# EAGLE design 6-line-matrix (EAGLE 9.3.1)
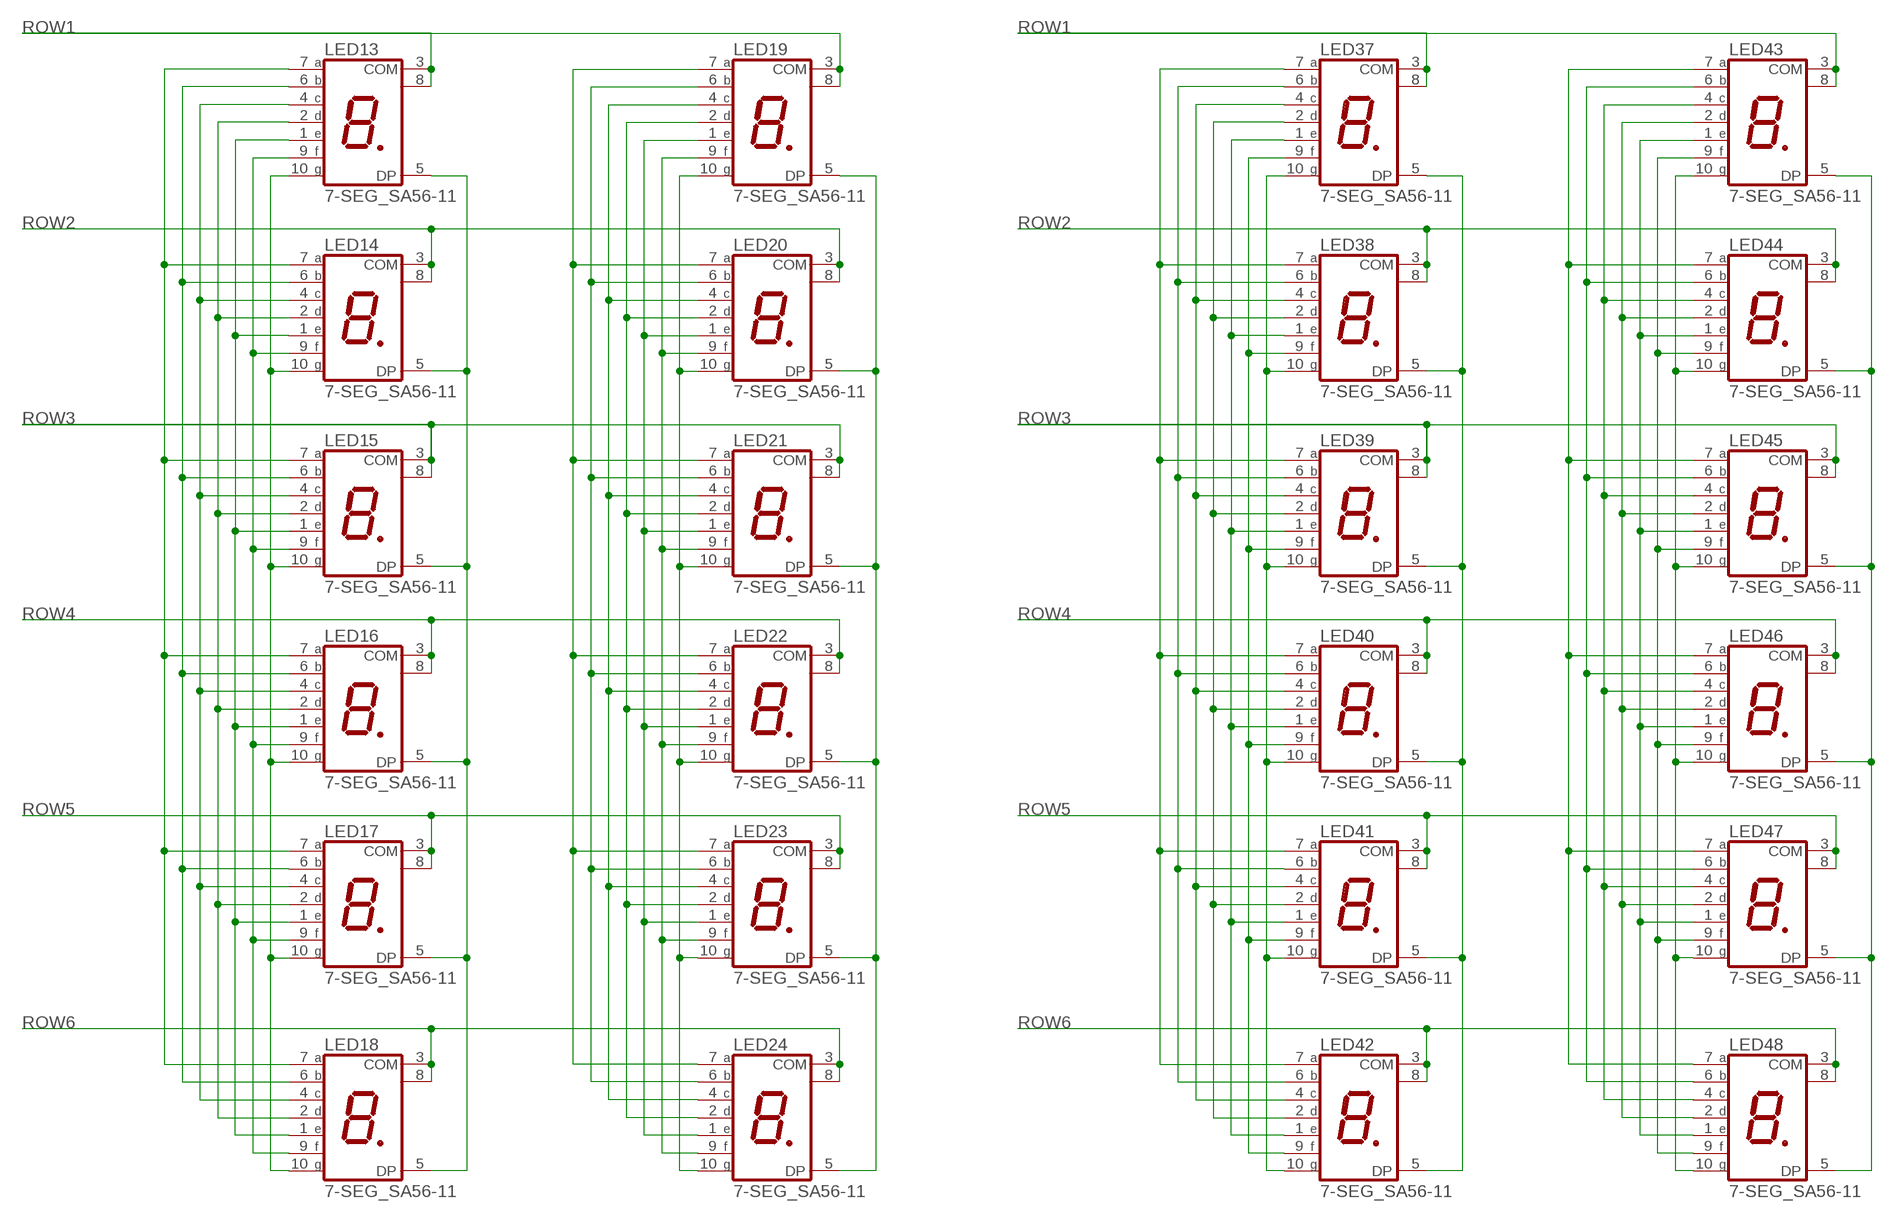
[diagram p0: schematic, sheet 1, part 1 of 2]
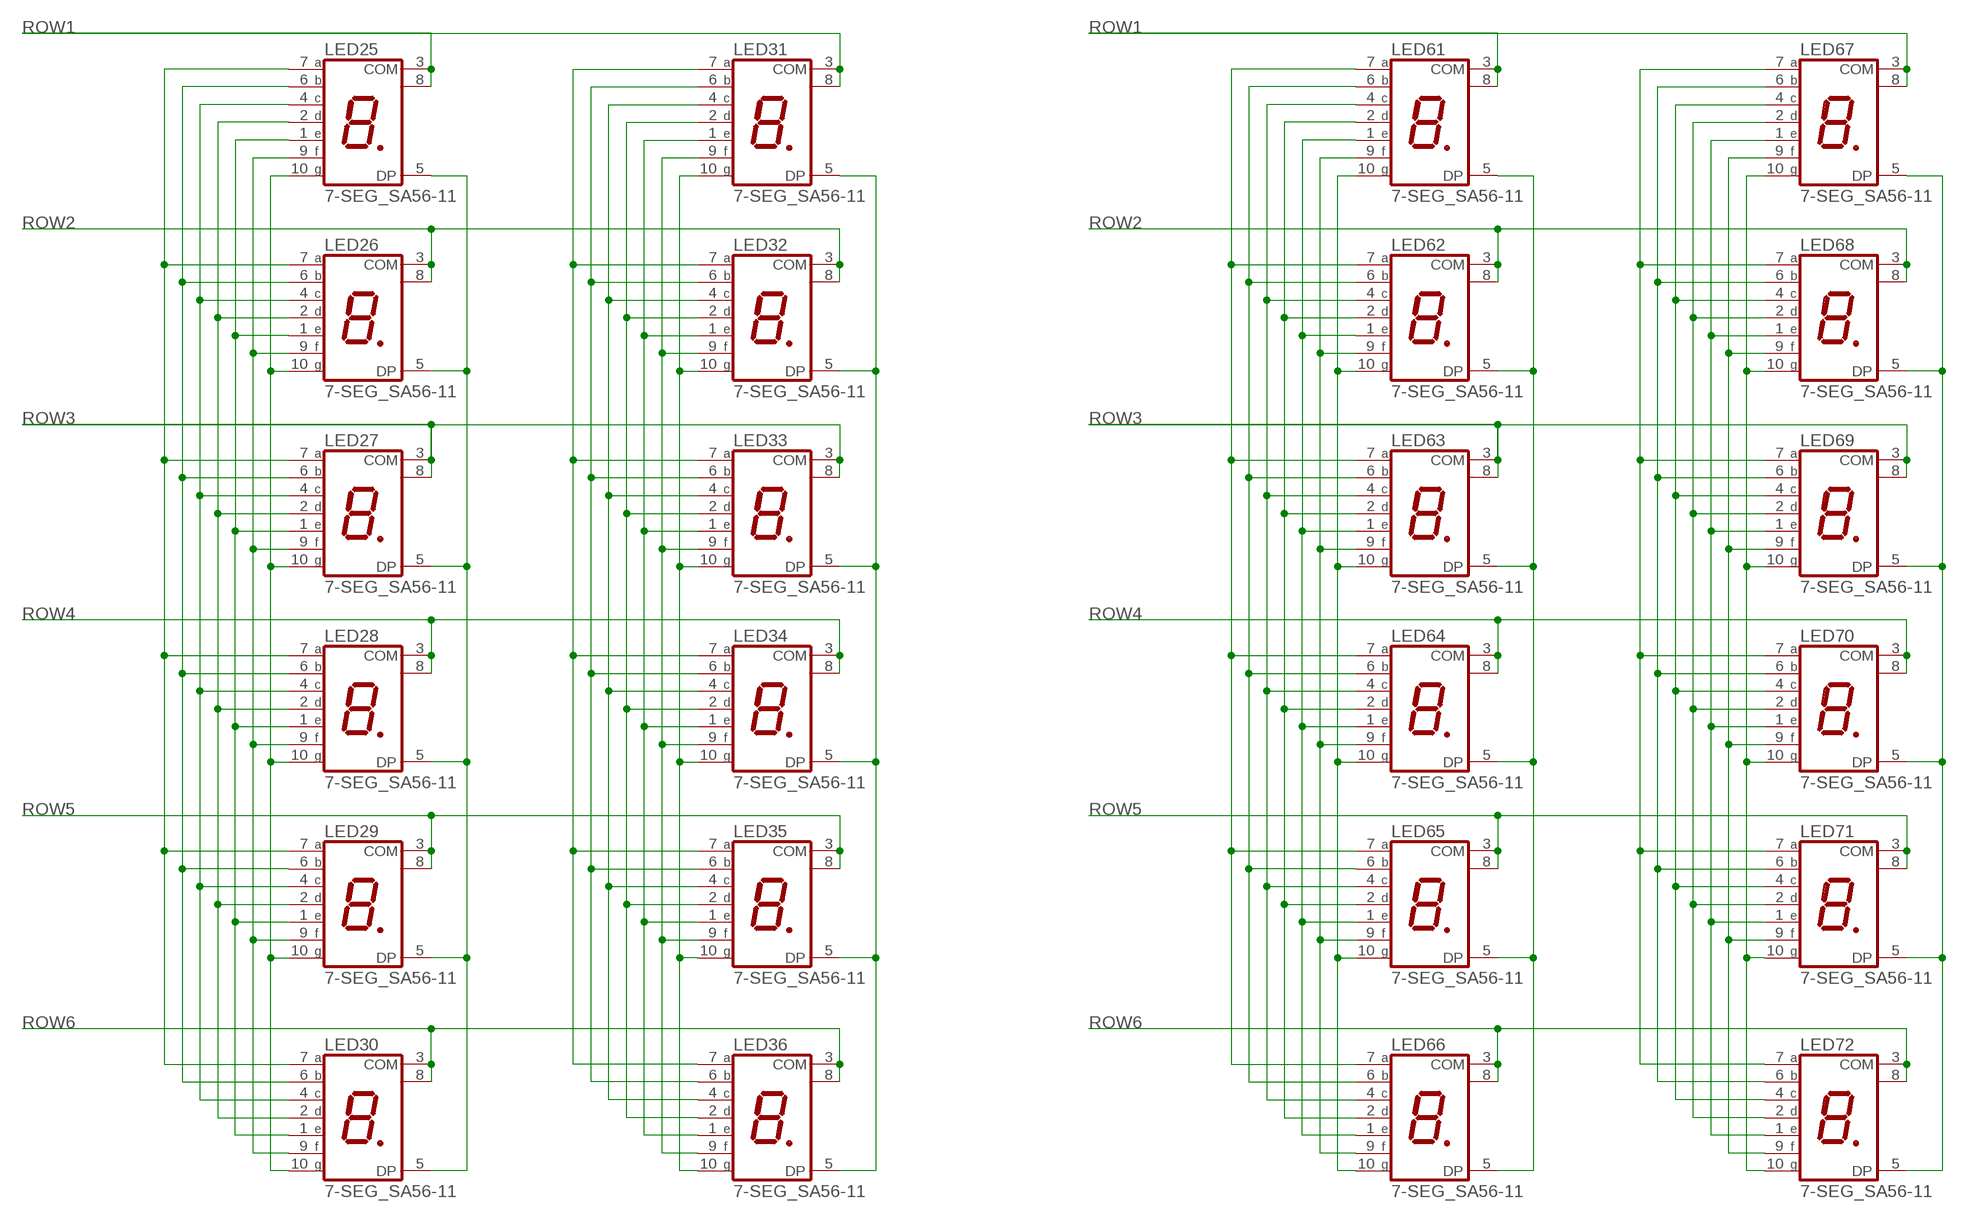
[diagram p1: schematic, sheet 1, part 2 of 2]

## Parts
LED13  7-SEG_SA56-11  [SA56-11]
LED14  7-SEG_SA56-11  [SA56-11]
LED15  7-SEG_SA56-11  [SA56-11]
LED16  7-SEG_SA56-11  [SA56-11]
LED17  7-SEG_SA56-11  [SA56-11]
LED18  7-SEG_SA56-11  [SA56-11]
LED19  7-SEG_SA56-11  [SA56-11]
LED20  7-SEG_SA56-11  [SA56-11]
LED21  7-SEG_SA56-11  [SA56-11]
LED22  7-SEG_SA56-11  [SA56-11]
LED23  7-SEG_SA56-11  [SA56-11]
LED24  7-SEG_SA56-11  [SA56-11]
LED25  7-SEG_SA56-11  [SA56-11]
LED26  7-SEG_SA56-11  [SA56-11]
LED27  7-SEG_SA56-11  [SA56-11]
LED28  7-SEG_SA56-11  [SA56-11]
LED29  7-SEG_SA56-11  [SA56-11]
LED30  7-SEG_SA56-11  [SA56-11]
LED31  7-SEG_SA56-11  [SA56-11]
LED32  7-SEG_SA56-11  [SA56-11]
LED33  7-SEG_SA56-11  [SA56-11]
LED34  7-SEG_SA56-11  [SA56-11]
LED35  7-SEG_SA56-11  [SA56-11]
LED36  7-SEG_SA56-11  [SA56-11]
LED37  7-SEG_SA56-11  [SA56-11]
LED38  7-SEG_SA56-11  [SA56-11]
LED39  7-SEG_SA56-11  [SA56-11]
LED40  7-SEG_SA56-11  [SA56-11]
LED41  7-SEG_SA56-11  [SA56-11]
LED42  7-SEG_SA56-11  [SA56-11]
LED43  7-SEG_SA56-11  [SA56-11]
LED44  7-SEG_SA56-11  [SA56-11]
LED45  7-SEG_SA56-11  [SA56-11]
LED46  7-SEG_SA56-11  [SA56-11]
LED47  7-SEG_SA56-11  [SA56-11]
LED48  7-SEG_SA56-11  [SA56-11]
LED61  7-SEG_SA56-11  [SA56-11]
LED62  7-SEG_SA56-11  [SA56-11]
LED63  7-SEG_SA56-11  [SA56-11]
LED64  7-SEG_SA56-11  [SA56-11]
LED65  7-SEG_SA56-11  [SA56-11]
LED66  7-SEG_SA56-11  [SA56-11]
LED67  7-SEG_SA56-11  [SA56-11]
LED68  7-SEG_SA56-11  [SA56-11]
LED69  7-SEG_SA56-11  [SA56-11]
LED70  7-SEG_SA56-11  [SA56-11]
LED71  7-SEG_SA56-11  [SA56-11]
LED72  7-SEG_SA56-11  [SA56-11]

## Nets
N$17: LED13.7(A) LED14.7(A) LED15.7(A) LED16.7(A) LED17.7(A) LED18.7(A)
N$18: LED13.6(B) LED14.6(B) LED15.6(B) LED16.6(B) LED17.6(B) LED18.6(B)
N$19: LED13.10(G) LED14.10(G) LED15.10(G) LED16.10(G) LED17.10(G) LED18.10(G)
N$20: LED13.9(F) LED14.9(F) LED15.9(F) LED16.9(F) LED17.9(F) LED18.9(F)
N$21: LED13.1(E) LED14.1(E) LED15.1(E) LED16.1(E) LED17.1(E) LED18.1(E)
N$22: LED13.2(D) LED14.2(D) LED15.2(D) LED16.2(D) LED17.2(D) LED18.2(D)
N$23: LED13.4(C) LED14.4(C) LED15.4(C) LED16.4(C) LED17.4(C) LED18.4(C)
N$24: LED13.5(DP) LED14.5(DP) LED15.5(DP) LED16.5(DP) LED17.5(DP) LED18.5(DP)
N$25: LED19.10(G) LED20.10(G) LED21.10(G) LED22.10(G) LED23.10(G) LED24.10(G)
N$26: LED19.9(F) LED20.9(F) LED21.9(F) LED22.9(F) LED23.9(F) LED24.9(F)
N$27: LED19.1(E) LED20.1(E) LED21.1(E) LED22.1(E) LED23.1(E) LED24.1(E)
N$28: LED19.2(D) LED20.2(D) LED21.2(D) LED22.2(D) LED23.2(D) LED24.2(D)
N$29: LED19.4(C) LED20.4(C) LED21.4(C) LED22.4(C) LED23.4(C) LED24.4(C)
N$30: LED19.6(B) LED20.6(B) LED21.6(B) LED22.6(B) LED23.6(B) LED24.6(B)
N$31: LED19.7(A) LED20.7(A) LED21.7(A) LED22.7(A) LED23.7(A) LED24.7(A)
N$32: LED19.5(DP) LED20.5(DP) LED21.5(DP) LED22.5(DP) LED23.5(DP) LED24.5(DP)
N$33: LED25.7(A) LED26.7(A) LED27.7(A) LED28.7(A) LED29.7(A) LED30.7(A)
N$34: LED25.6(B) LED26.6(B) LED27.6(B) LED28.6(B) LED29.6(B) LED30.6(B)
N$35: LED25.10(G) LED26.10(G) LED27.10(G) LED28.10(G) LED29.10(G) LED30.10(G)
N$36: LED25.9(F) LED26.9(F) LED27.9(F) LED28.9(F) LED29.9(F) LED30.9(F)
N$37: LED25.1(E) LED26.1(E) LED27.1(E) LED28.1(E) LED29.1(E) LED30.1(E)
N$38: LED25.2(D) LED26.2(D) LED27.2(D) LED28.2(D) LED29.2(D) LED30.2(D)
N$39: LED25.4(C) LED26.4(C) LED27.4(C) LED28.4(C) LED29.4(C) LED30.4(C)
N$40: LED25.5(DP) LED26.5(DP) LED27.5(DP) LED28.5(DP) LED29.5(DP) LED30.5(DP)
N$41: LED31.10(G) LED32.10(G) LED33.10(G) LED34.10(G) LED35.10(G) LED36.10(G)
N$42: LED31.9(F) LED32.9(F) LED33.9(F) LED34.9(F) LED35.9(F) LED36.9(F)
N$43: LED31.1(E) LED32.1(E) LED33.1(E) LED34.1(E) LED35.1(E) LED36.1(E)
N$44: LED31.2(D) LED32.2(D) LED33.2(D) LED34.2(D) LED35.2(D) LED36.2(D)
N$45: LED31.4(C) LED32.4(C) LED33.4(C) LED34.4(C) LED35.4(C) LED36.4(C)
N$46: LED31.6(B) LED32.6(B) LED33.6(B) LED34.6(B) LED35.6(B) LED36.6(B)
N$47: LED31.7(A) LED32.7(A) LED33.7(A) LED34.7(A) LED35.7(A) LED36.7(A)
N$48: LED31.5(DP) LED32.5(DP) LED33.5(DP) LED34.5(DP) LED35.5(DP) LED36.5(DP)
N$49: LED37.7(A) LED38.7(A) LED39.7(A) LED40.7(A) LED41.7(A) LED42.7(A)
N$50: LED37.6(B) LED38.6(B) LED39.6(B) LED40.6(B) LED41.6(B) LED42.6(B)
N$51: LED37.10(G) LED38.10(G) LED39.10(G) LED40.10(G) LED41.10(G) LED42.10(G)
N$52: LED37.9(F) LED38.9(F) LED39.9(F) LED40.9(F) LED41.9(F) LED42.9(F)
N$53: LED37.1(E) LED38.1(E) LED39.1(E) LED40.1(E) LED41.1(E) LED42.1(E)
N$54: LED37.2(D) LED38.2(D) LED39.2(D) LED40.2(D) LED41.2(D) LED42.2(D)
N$55: LED37.4(C) LED38.4(C) LED39.4(C) LED40.4(C) LED41.4(C) LED42.4(C)
N$56: LED37.5(DP) LED38.5(DP) LED39.5(DP) LED40.5(DP) LED41.5(DP) LED42.5(DP)
N$57: LED43.10(G) LED44.10(G) LED45.10(G) LED46.10(G) LED47.10(G) LED48.10(G)
N$58: LED43.9(F) LED44.9(F) LED45.9(F) LED46.9(F) LED47.9(F) LED48.9(F)
N$59: LED43.1(E) LED44.1(E) LED45.1(E) LED46.1(E) LED47.1(E) LED48.1(E)
N$60: LED43.2(D) LED44.2(D) LED45.2(D) LED46.2(D) LED47.2(D) LED48.2(D)
N$61: LED43.4(C) LED44.4(C) LED45.4(C) LED46.4(C) LED47.4(C) LED48.4(C)
N$62: LED43.6(B) LED44.6(B) LED45.6(B) LED46.6(B) LED47.6(B) LED48.6(B)
N$63: LED43.7(A) LED44.7(A) LED45.7(A) LED46.7(A) LED47.7(A) LED48.7(A)
N$64: LED43.5(DP) LED44.5(DP) LED45.5(DP) LED46.5(DP) LED47.5(DP) LED48.5(DP)
N$81: LED61.7(A) LED62.7(A) LED63.7(A) LED64.7(A) LED65.7(A) LED66.7(A)
N$82: LED61.6(B) LED62.6(B) LED63.6(B) LED64.6(B) LED65.6(B) LED66.6(B)
N$83: LED61.10(G) LED62.10(G) LED63.10(G) LED64.10(G) LED65.10(G) LED66.10(G)
N$84: LED61.9(F) LED62.9(F) LED63.9(F) LED64.9(F) LED65.9(F) LED66.9(F)
N$85: LED61.1(E) LED62.1(E) LED63.1(E) LED64.1(E) LED65.1(E) LED66.1(E)
N$86: LED61.2(D) LED62.2(D) LED63.2(D) LED64.2(D) LED65.2(D) LED66.2(D)
N$87: LED61.4(C) LED62.4(C) LED63.4(C) LED64.4(C) LED65.4(C) LED66.4(C)
N$88: LED61.5(DP) LED62.5(DP) LED63.5(DP) LED64.5(DP) LED65.5(DP) LED66.5(DP)
N$89: LED67.10(G) LED68.10(G) LED69.10(G) LED70.10(G) LED71.10(G) LED72.10(G)
N$90: LED67.9(F) LED68.9(F) LED69.9(F) LED70.9(F) LED71.9(F) LED72.9(F)
N$91: LED67.1(E) LED68.1(E) LED69.1(E) LED70.1(E) LED71.1(E) LED72.1(E)
N$92: LED67.2(D) LED68.2(D) LED69.2(D) LED70.2(D) LED71.2(D) LED72.2(D)
N$93: LED67.4(C) LED68.4(C) LED69.4(C) LED70.4(C) LED71.4(C) LED72.4(C)
N$94: LED67.6(B) LED68.6(B) LED69.6(B) LED70.6(B) LED71.6(B) LED72.6(B)
N$95: LED67.7(A) LED68.7(A) LED69.7(A) LED70.7(A) LED71.7(A) LED72.7(A)
N$96: LED67.5(DP) LED68.5(DP) LED69.5(DP) LED70.5(DP) LED71.5(DP) LED72.5(DP)
ROW1: LED13.3(COM) LED13.8(COM) LED19.3(COM) LED19.8(COM) LED25.3(COM) LED25.8(COM) LED31.3(COM) LED31.8(COM) LED37.3(COM) LED37.8(COM) LED43.3(COM) LED43.8(COM) LED61.3(COM) LED61.8(COM) LED67.3(COM) LED67.8(COM)
ROW2: LED14.3(COM) LED14.8(COM) LED20.3(COM) LED20.8(COM) LED26.3(COM) LED26.8(COM) LED32.3(COM) LED32.8(COM) LED38.3(COM) LED38.8(COM) LED44.3(COM) LED44.8(COM) LED62.3(COM) LED62.8(COM) LED68.3(COM) LED68.8(COM)
ROW3: LED15.3(COM) LED15.8(COM) LED21.3(COM) LED21.8(COM) LED27.3(COM) LED27.8(COM) LED33.3(COM) LED33.8(COM) LED39.3(COM) LED39.8(COM) LED45.3(COM) LED45.8(COM) LED63.3(COM) LED63.8(COM) LED69.3(COM) LED69.8(COM)
ROW4: LED16.3(COM) LED16.8(COM) LED22.3(COM) LED22.8(COM) LED28.3(COM) LED28.8(COM) LED34.3(COM) LED34.8(COM) LED40.3(COM) LED40.8(COM) LED46.3(COM) LED46.8(COM) LED64.3(COM) LED64.8(COM) LED70.3(COM) LED70.8(COM)
ROW5: LED17.3(COM) LED17.8(COM) LED23.3(COM) LED23.8(COM) LED29.3(COM) LED29.8(COM) LED35.3(COM) LED35.8(COM) LED41.3(COM) LED41.8(COM) LED47.3(COM) LED47.8(COM) LED65.3(COM) LED65.8(COM) LED71.3(COM) LED71.8(COM)
ROW6: LED18.3(COM) LED18.8(COM) LED24.3(COM) LED24.8(COM) LED30.3(COM) LED30.8(COM) LED36.3(COM) LED36.8(COM) LED42.3(COM) LED42.8(COM) LED48.3(COM) LED48.8(COM) LED66.3(COM) LED66.8(COM) LED72.3(COM) LED72.8(COM)

## Library data of the parts
LED13-LED48 LED61-LED72 = display-kingbright:7-SEG_: Kingbright 14.2mm (0.56 INCH) SINGLE DIGIT NUMERIC DUISPLAY Source: SA56-11EWA(Ver1189471036.pdf; OC_FARNELL: unknown; OC_NEWARK: unknown

## Board
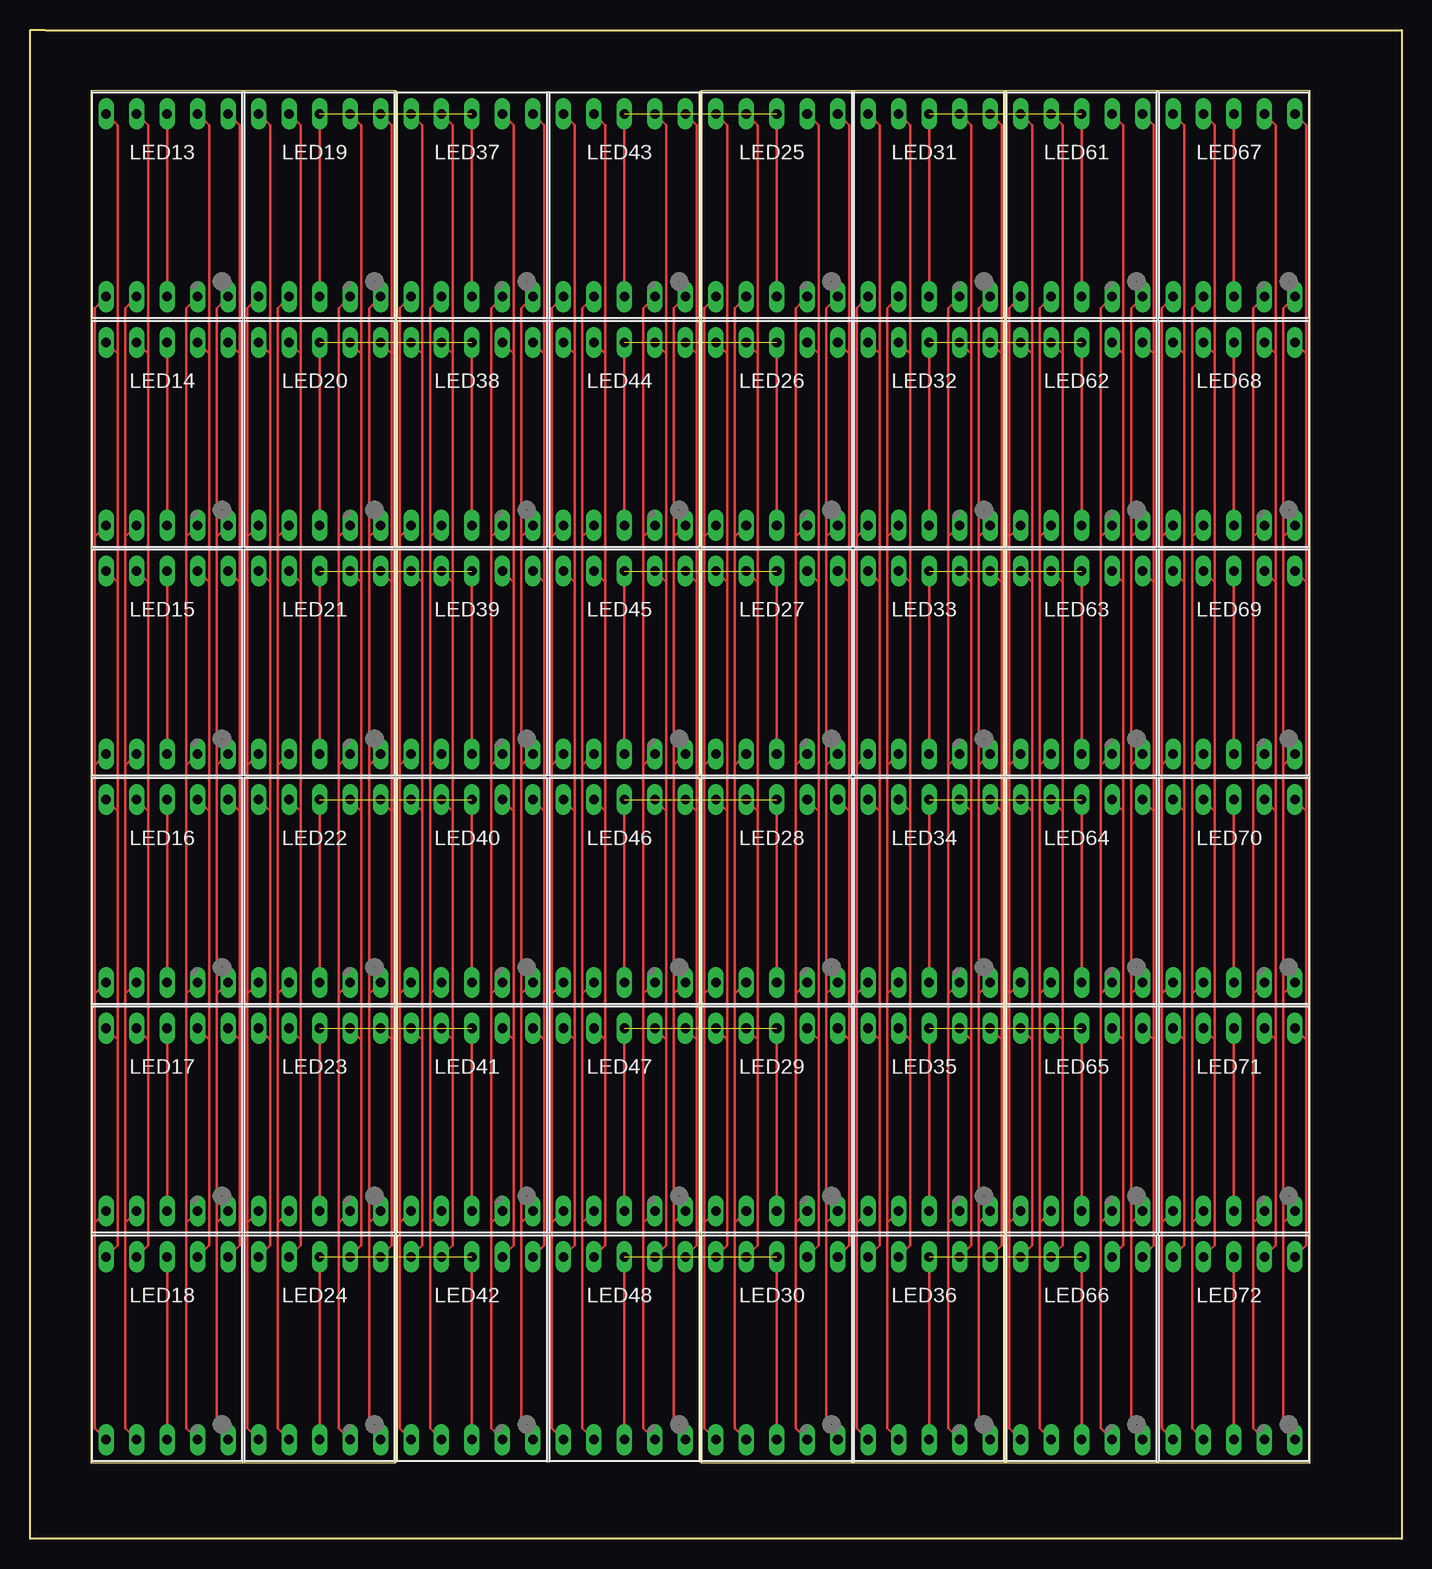
[diagram p2: board, top side]
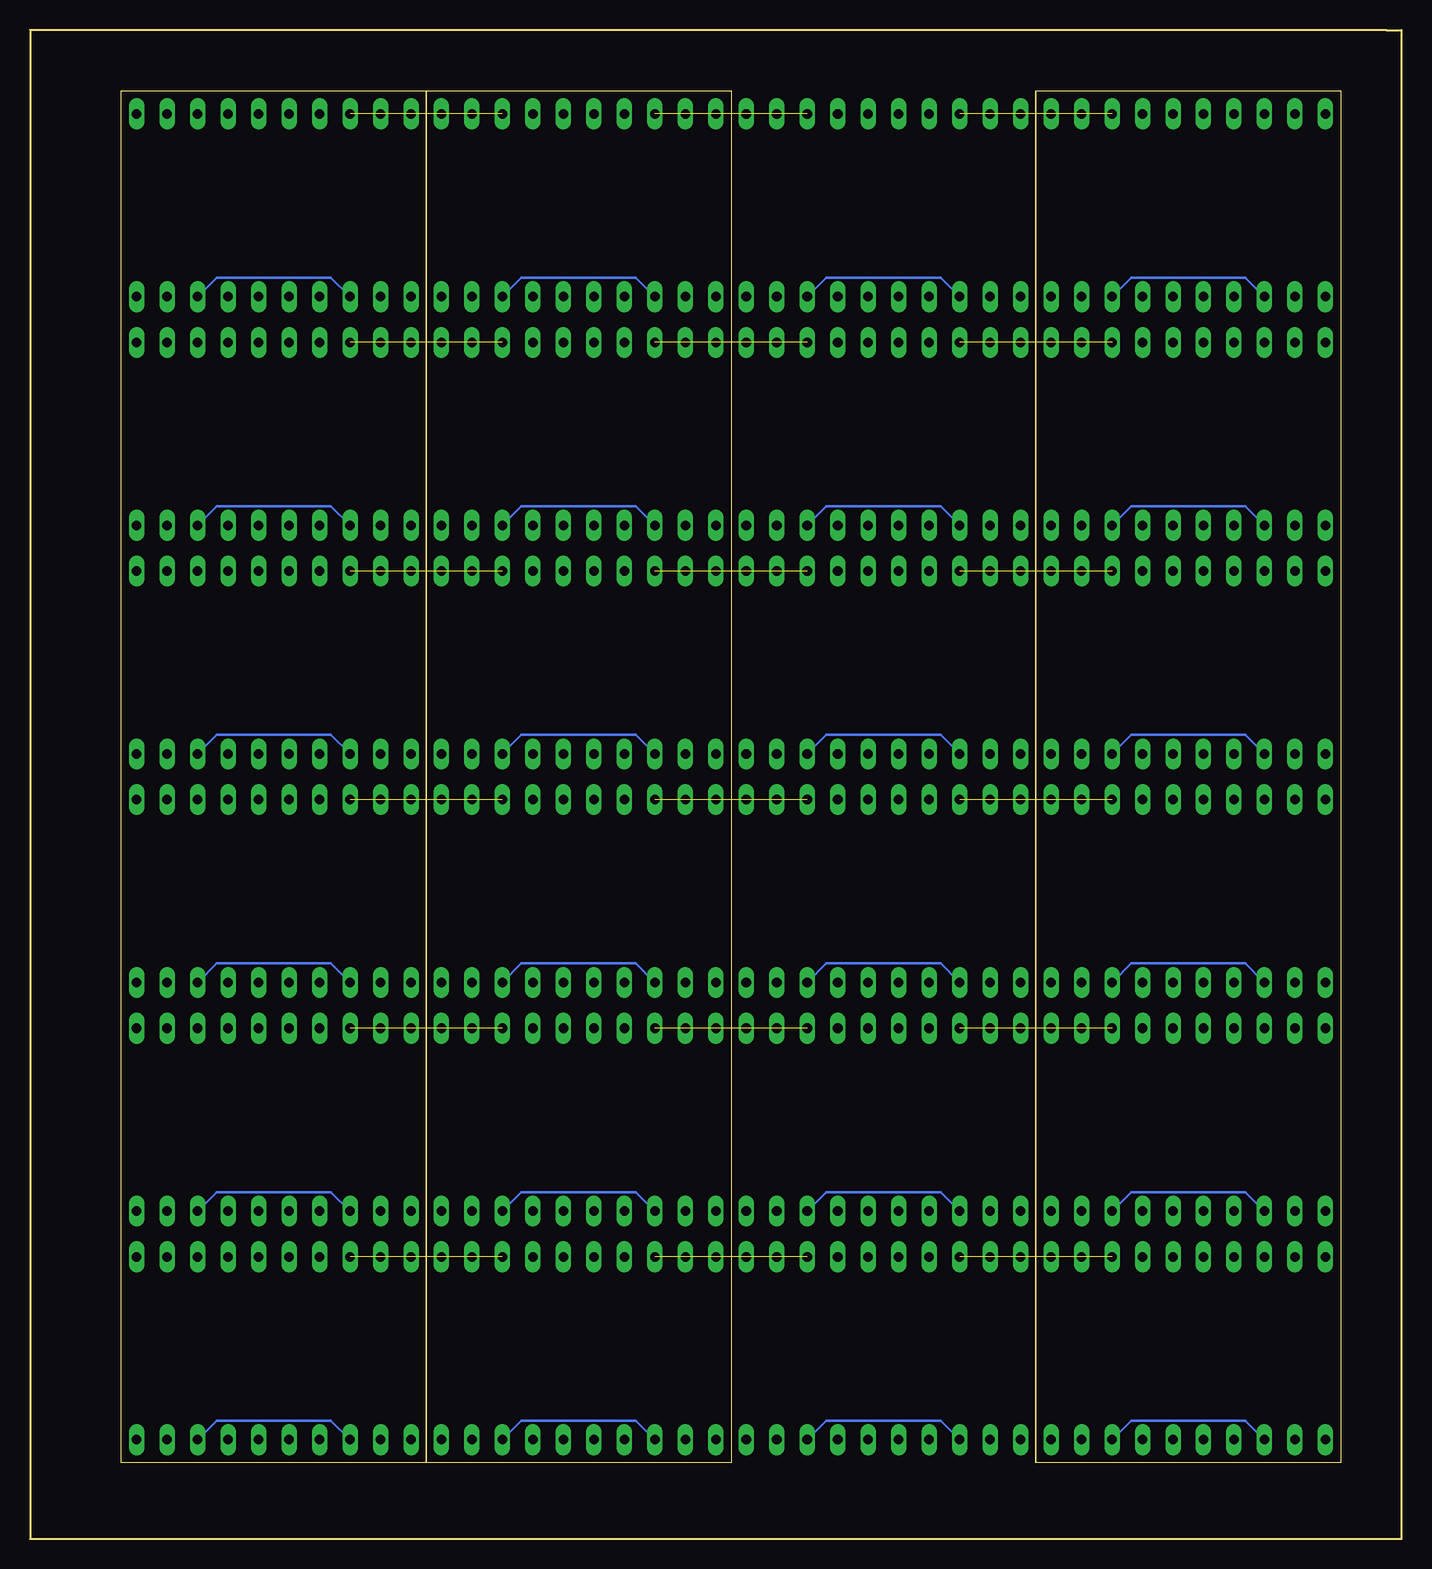
[diagram p3: board, bottom side, seen from below]

Size 114.3 x 125.73 mm. Coordinates in mm from the lower left corner, seen from the top.
Outline: 30.48,6.35 5.08,6.35 5.08,120.65 30.48,120.65
Outline: 30.48,6.35 30.48,120.65
Outline: 30.48,120.65 30.48,6.35
Outline: 81.28,6.35 55.88,6.35 55.88,120.65 81.28,120.65
Outline: 81.28,6.35 81.28,120.65
Outline: 81.28,6.35 106.68,6.35 106.68,120.65 81.28,120.65
Outline: 81.28,120.65 81.28,6.35
Outline: 1.27,125.73 114.3,125.73 114.3,0 0,0 0,125.73 1.27,125.73
Copper layers (1*16): Top 0.035mm / dielectric 1.5mm / Bottom 0.035mm
Design rules "default": minimum track width 6mil, minimum drill 0.35mm, track to track 6mil, track to pad 6mil, pad to pad 6mil, via to via 6mil, smd to smd 6mil, copper to edge 40mil, drill to drill 6mil, minimum pad ring 10mil, minimum via ring 8mil, stop-mask expansion 4mil, vias tented up to drill 0mil, thermal gap 10mil

### Footprints (pad centres in the part's own frame; a part is rotated, then mirrored left to right if it is on the bottom)
SA56-11 = drill 0.8 long: 1 -5.08,-7.62; 2 -2.54,-7.62; 3 0,-7.62; 4 2.54,-7.62; 5 5.08,-7.62; 6 5.08,7.62; 7 2.54,7.62; 8 0,7.62; 9 -2.54,7.62; 10 -5.08,7.62

### Placement (x,y rotation side)
LED13  11.43,111.12 0 top
LED14  11.43,92.07 0 top
LED15  11.43,73.02 0 top
LED16  11.43,53.98 0 top
LED17  11.43,34.92 0 top
LED18  11.43,15.88 0 top
LED19  24.13,111.12 0 top
LED20  24.13,92.07 0 top
LED21  24.13,73.02 0 top
LED22  24.13,53.98 0 top
LED23  24.13,34.92 0 top
LED24  24.13,15.88 0 top
LED25  62.23,111.12 0 top
LED26  62.23,92.07 0 top
LED27  62.23,73.02 0 top
LED28  62.23,53.98 0 top
LED29  62.23,34.92 0 top
LED30  62.23,15.88 0 top
LED31  74.93,111.12 0 top
LED32  74.93,92.07 0 top
LED33  74.93,73.02 0 top
LED34  74.93,53.98 0 top
LED35  74.93,34.92 0 top
LED36  74.93,15.88 0 top
LED37  36.83,111.12 0 top
LED38  36.83,92.07 0 top
LED39  36.83,73.02 0 top
LED40  36.83,53.98 0 top
LED41  36.83,34.92 0 top
LED42  36.83,15.88 0 top
LED43  49.53,111.12 0 top
LED44  49.53,92.07 0 top
LED45  49.53,73.02 0 top
LED46  49.53,53.98 0 top
LED47  49.53,34.92 0 top
LED48  49.53,15.88 0 top
LED61  87.63,111.12 0 top
LED62  87.63,92.07 0 top
LED63  87.63,73.02 0 top
LED64  87.63,53.98 0 top
LED65  87.63,34.92 0 top
LED66  87.63,15.88 0 top
LED67  100.33,111.12 0 top
LED68  100.33,92.07 0 top
LED69  100.33,73.02 0 top
LED70  100.33,53.98 0 top
LED71  100.33,34.92 0 top
LED72  100.33,15.88 0 top

### Tracks (layer width: path | path; a pad name or v marks a point on that pad's centre or on a via)
N$17
  Top 0.203: LED18.7 14.92,24.45 14.92,41.59 | LED17.7 14.92,41.59 | 14.92,60.64 LED16.7 | 14.92,41.59 14.92,60.64 | 14.92,79.69 LED15.7 | 14.92,60.64 14.92,79.69 | 14.92,98.74 LED14.7 | 14.92,79.69 14.92,98.74 | LED13.7 14.92,117.79 14.92,98.74
N$18
  Top 0.203: LED18.6 17.46,24.45 17.46,41.59 | LED17.6 17.46,41.59 | 17.46,60.64 LED16.6 | 17.46,41.59 17.46,60.64 | 17.46,79.69 LED15.6 | 17.46,60.64 17.46,79.69 | 17.46,98.74 LED14.6 | 17.46,79.69 17.46,98.74 | LED13.6 17.46,117.79 17.46,98.74
N$19
  Top 0.203: LED18.10 7.3,24.45 7.3,41.59 | LED17.10 7.3,41.59 | 7.3,60.64 LED16.10 | 7.3,41.59 7.3,60.64 | 7.3,79.69 LED15.10 | 7.3,60.64 7.3,79.69 | 7.3,98.74 LED14.10 | 7.3,79.69 7.3,98.74 | LED13.10 7.3,117.79 7.3,98.74
N$20
  Top 0.203: LED18.9 9.84,24.45 9.84,41.59 | LED17.9 9.84,41.59 | 9.84,60.64 LED16.9 | 9.84,41.59 9.84,60.64 | 9.84,79.69 LED15.9 | 9.84,60.64 9.84,79.69 | 9.84,98.74 LED14.9 | 9.84,79.69 9.84,98.74 | LED13.9 9.84,117.79 9.84,98.74
N$21
  Top 0.203: LED18.1 5.4,9.21 5.4,26.35 | LED17.1 5.4,26.35 | 5.4,45.4 LED16.1 | 5.4,26.35 5.4,45.4 | 5.4,64.45 LED15.1 | 5.4,45.4 5.4,64.45 | 5.4,83.5 LED14.1 | 5.4,64.45 5.4,83.5 | LED13.1 5.4,102.55 5.4,83.5
N$22
  Top 0.203: LED18.2 7.94,9.21 7.94,26.35 | LED17.2 7.94,26.35 | 7.94,45.4 LED16.2 | 7.94,26.35 7.94,45.4 | 7.94,64.45 LED15.2 | 7.94,45.4 7.94,64.45 | 7.94,83.5 LED14.2 | 7.94,64.45 7.94,83.5 | LED13.2 7.94,102.55 7.94,83.5
N$23
  Top 0.203: LED18.4 13.02,9.21 13.02,26.35 | LED17.4 13.02,26.35 | 13.02,45.4 LED16.4 | 13.02,26.35 13.02,45.4 | 13.02,64.45 LED15.4 | 13.02,45.4 13.02,64.45 | 13.02,83.5 LED14.4 | 13.02,64.45 13.02,83.5 | LED13.4 13.02,102.55 13.02,83.5
N$24
  Top 0.203: LED18.5 15.56,9.21 15.56,26.35 | LED17.5 15.56,26.35 | 15.56,45.4 LED16.5 | 15.56,26.35 15.56,45.4 | 15.56,64.45 LED15.5 | 15.56,45.4 15.56,64.45 | 15.56,83.5 LED14.5 | 15.56,64.45 15.56,83.5 | LED13.5 15.56,102.55 15.56,83.5
N$25
  Top 0.203: LED24.10 20,24.45 20,41.59 | LED23.10 20,41.59 | 20,60.64 LED22.10 | 20,41.59 20,60.64 | 20,79.69 LED21.10 | 20,60.64 20,79.69 | 20,98.74 LED20.10 | 20,79.69 20,98.74 | LED19.10 20,117.79 20,98.74
N$26
  Top 0.203: LED24.9 22.54,24.45 22.54,41.59 | LED23.9 22.54,41.59 | 22.54,60.64 LED22.9 | 22.54,41.59 22.54,60.64 | 22.54,79.69 LED21.9 | 22.54,60.64 22.54,79.69 | 22.54,98.74 LED20.9 | 22.54,79.69 22.54,98.74 | LED19.9 22.54,117.79 22.54,98.74
N$27
  Top 0.203: LED24.1 18.1,9.21 18.1,26.35 | LED23.1 18.1,26.35 | 18.1,45.4 LED22.1 | 18.1,26.35 18.1,45.4 | 18.1,64.45 LED21.1 | 18.1,45.4 18.1,64.45 | 18.1,83.5 LED20.1 | 18.1,64.45 18.1,83.5 | LED19.1 18.1,102.55 18.1,83.5
N$28
  Top 0.203: LED24.2 20.64,9.21 20.64,26.35 | LED23.2 20.64,26.35 | 20.64,45.4 LED22.2 | 20.64,26.35 20.64,45.4 | 20.64,64.45 LED21.2 | 20.64,45.4 20.64,64.45 | 20.64,83.5 LED20.2 | 20.64,64.45 20.64,83.5 | LED19.2 20.64,102.55 20.64,83.5
N$29
  Top 0.203: LED24.4 25.72,9.21 25.72,26.35 | LED23.4 25.72,26.35 | 25.72,45.4 LED22.4 | 25.72,26.35 25.72,45.4 | 25.72,64.45 LED21.4 | 25.72,45.4 25.72,64.45 | 25.72,83.5 LED20.4 | 25.72,64.45 25.72,83.5 | LED19.4 25.72,102.55 25.72,83.5
N$30
  Top 0.203: LED24.6 30.16,24.45 30.16,41.59 | LED23.6 30.16,41.59 | 30.16,60.64 LED22.6 | 30.16,41.59 30.16,60.64 | 30.16,79.69 LED21.6 | 30.16,60.64 30.16,79.69 | 30.16,98.74 LED20.6 | 30.16,79.69 30.16,98.74 | LED19.6 30.16,117.79 30.16,98.74
N$31
  Top 0.203: LED24.7 27.62,24.45 27.62,41.59 | LED23.7 27.62,41.59 | 27.62,60.64 LED22.7 | 27.62,41.59 27.62,60.64 | 27.62,79.69 LED21.7 | 27.62,60.64 27.62,79.69 | 27.62,98.74 LED20.7 | 27.62,79.69 27.62,98.74 | LED19.7 27.62,117.79 27.62,98.74
N$32
  Top 0.203: LED24.5 28.26,9.21 28.26,26.35 | LED23.5 28.26,26.35 | 28.26,45.4 LED22.5 | 28.26,26.35 28.26,45.4 | 28.26,64.45 LED21.5 | 28.26,45.4 28.26,64.45 | 28.26,83.5 LED20.5 | 28.26,64.45 28.26,83.5 | LED19.5 28.26,102.55 28.26,83.5
N$33
  Top 0.203: LED30.7 65.72,24.45 65.72,41.59 | LED29.7 65.72,41.59 | 65.72,60.64 LED28.7 | 65.72,41.59 65.72,60.64 | 65.72,79.69 LED27.7 | 65.72,60.64 65.72,79.69 | 65.72,98.74 LED26.7 | 65.72,79.69 65.72,98.74 | LED25.7 65.72,117.79 65.72,98.74
N$34
  Top 0.203: LED30.6 68.26,24.45 68.26,41.59 | LED29.6 68.26,41.59 | 68.26,60.64 LED28.6 | 68.26,41.59 68.26,60.64 | 68.26,79.69 LED27.6 | 68.26,60.64 68.26,79.69 | 68.26,98.74 LED26.6 | 68.26,79.69 68.26,98.74 | LED25.6 68.26,117.79 68.26,98.74
N$35
  Top 0.203: LED30.10 58.1,24.45 58.1,41.59 | LED29.10 58.1,41.59 | 58.1,60.64 LED28.10 | 58.1,41.59 58.1,60.64 | 58.1,79.69 LED27.10 | 58.1,60.64 58.1,79.69 | 58.1,98.74 LED26.10 | 58.1,79.69 58.1,98.74 | LED25.10 58.1,117.79 58.1,98.74
N$36
  Top 0.203: LED30.9 60.64,24.45 60.64,41.59 | LED29.9 60.64,41.59 | 60.64,60.64 LED28.9 | 60.64,41.59 60.64,60.64 | 60.64,79.69 LED27.9 | 60.64,60.64 60.64,79.69 | 60.64,98.74 LED26.9 | 60.64,79.69 60.64,98.74 | LED25.9 60.64,117.79 60.64,98.74
N$37
  Top 0.203: LED30.1 56.2,9.21 56.2,26.35 | LED29.1 56.2,26.35 | 56.2,45.4 LED28.1 | 56.2,26.35 56.2,45.4 | 56.2,64.45 LED27.1 | 56.2,45.4 56.2,64.45 | 56.2,83.5 LED26.1 | 56.2,64.45 56.2,83.5 | LED25.1 56.2,102.55 56.2,83.5
N$38
  Top 0.203: LED30.2 58.74,9.21 58.74,26.35 | LED29.2 58.74,26.35 | 58.74,45.4 LED28.2 | 58.74,26.35 58.74,45.4 | 58.74,64.45 LED27.2 | 58.74,45.4 58.74,64.45 | 58.74,83.5 LED26.2 | 58.74,64.45 58.74,83.5 | LED25.2 58.74,102.55 58.74,83.5
N$39
  Top 0.203: LED30.4 63.82,9.21 63.82,26.35 | LED29.4 63.82,26.35 | 63.82,45.4 LED28.4 | 63.82,26.35 63.82,45.4 | 63.82,64.45 LED27.4 | 63.82,45.4 63.82,64.45 | 63.82,83.5 LED26.4 | 63.82,64.45 63.82,83.5 | LED25.4 63.82,102.55 63.82,83.5
N$40
  Top 0.203: LED30.5 66.36,9.21 66.36,26.35 | LED29.5 66.36,26.35 | 66.36,45.4 LED28.5 | 66.36,26.35 66.36,45.4 | 66.36,64.45 LED27.5 | 66.36,45.4 66.36,64.45 | 66.36,83.5 LED26.5 | 66.36,64.45 66.36,83.5 | LED25.5 66.36,102.55 66.36,83.5
N$41
  Top 0.203: LED36.10 70.8,24.45 70.8,41.59 | LED35.10 70.8,41.59 | 70.8,60.64 LED34.10 | 70.8,41.59 70.8,60.64 | 70.8,79.69 LED33.10 | 70.8,60.64 70.8,79.69 | 70.8,98.74 LED32.10 | 70.8,79.69 70.8,98.74 | LED31.10 70.8,117.79 70.8,98.74
N$42
  Top 0.203: LED36.9 73.34,24.45 73.34,41.59 | LED35.9 73.34,41.59 | 73.34,60.64 LED34.9 | 73.34,41.59 73.34,60.64 | 73.34,79.69 LED33.9 | 73.34,60.64 73.34,79.69 | 73.34,98.74 LED32.9 | 73.34,79.69 73.34,98.74 | LED31.9 73.34,117.79 73.34,98.74
N$43
  Top 0.203: LED36.1 68.9,9.21 68.9,26.35 | LED35.1 68.9,26.35 | 68.9,45.4 LED34.1 | 68.9,26.35 68.9,45.4 | 68.9,64.45 LED33.1 | 68.9,45.4 68.9,64.45 | 68.9,83.5 LED32.1 | 68.9,64.45 68.9,83.5 | LED31.1 68.9,102.55 68.9,83.5
N$44
  Top 0.203: LED36.2 71.44,9.21 71.44,26.35 | LED35.2 71.44,26.35 | 71.44,45.4 LED34.2 | 71.44,26.35 71.44,45.4 | 71.44,64.45 LED33.2 | 71.44,45.4 71.44,64.45 | 71.44,83.5 LED32.2 | 71.44,64.45 71.44,83.5 | LED31.2 71.44,102.55 71.44,83.5
N$45
  Top 0.203: LED36.4 76.52,9.21 76.52,26.35 | LED35.4 76.52,26.35 | 76.52,45.4 LED34.4 | 76.52,26.35 76.52,45.4 | 76.52,64.45 LED33.4 | 76.52,45.4 76.52,64.45 | 76.52,83.5 LED32.4 | 76.52,64.45 76.52,83.5 | LED31.4 76.52,102.55 76.52,83.5
N$46
  Top 0.203: LED36.6 80.96,24.45 80.96,41.59 | LED35.6 80.96,41.59 | 80.96,60.64 LED34.6 | 80.96,41.59 80.96,60.64 | 80.96,79.69 LED33.6 | 80.96,60.64 80.96,79.69 | 80.96,98.74 LED32.6 | 80.96,79.69 80.96,98.74 | LED31.6 80.96,117.79 80.96,98.74
N$47
  Top 0.203: LED36.7 78.42,24.45 78.42,41.59 | LED35.7 78.42,41.59 | 78.42,60.64 LED34.7 | 78.42,41.59 78.42,60.64 | 78.42,79.69 LED33.7 | 78.42,60.64 78.42,79.69 | 78.42,98.74 LED32.7 | 78.42,79.69 78.42,98.74 | LED31.7 78.42,117.79 78.42,98.74
N$48
  Top 0.203: LED36.5 79.06,9.21 79.06,26.35 | LED35.5 79.06,26.35 | 79.06,45.4 LED34.5 | 79.06,26.35 79.06,45.4 | 79.06,64.45 LED33.5 | 79.06,45.4 79.06,64.45 | 79.06,83.5 LED32.5 | 79.06,64.45 79.06,83.5 | LED31.5 79.06,102.55 79.06,83.5
N$49
  Top 0.203: LED42.7 40.32,24.45 40.32,41.59 | LED41.7 40.32,41.59 | 40.32,60.64 LED40.7 | 40.32,41.59 40.32,60.64 | 40.32,79.69 LED39.7 | 40.32,60.64 40.32,79.69 | 40.32,98.74 LED38.7 | 40.32,79.69 40.32,98.74 | LED37.7 40.32,117.79 40.32,98.74
N$50
  Top 0.203: LED42.6 42.86,24.45 42.86,41.59 | LED41.6 42.86,41.59 | 42.86,60.64 LED40.6 | 42.86,41.59 42.86,60.64 | 42.86,79.69 LED39.6 | 42.86,60.64 42.86,79.69 | 42.86,98.74 LED38.6 | 42.86,79.69 42.86,98.74 | LED37.6 42.86,117.79 42.86,98.74
N$51
  Top 0.203: LED42.10 32.7,24.45 32.7,41.59 | LED41.10 32.7,41.59 | 32.7,60.64 LED40.10 | 32.7,41.59 32.7,60.64 | 32.7,79.69 LED39.10 | 32.7,60.64 32.7,79.69 | 32.7,98.74 LED38.10 | 32.7,79.69 32.7,98.74 | LED37.10 32.7,117.79 32.7,98.74
N$52
  Top 0.203: LED42.9 35.24,24.45 35.24,41.59 | LED41.9 35.24,41.59 | 35.24,60.64 LED40.9 | 35.24,41.59 35.24,60.64 | 35.24,79.69 LED39.9 | 35.24,60.64 35.24,79.69 | 35.24,98.74 LED38.9 | 35.24,79.69 35.24,98.74 | LED37.9 35.24,117.79 35.24,98.74
N$53
  Top 0.203: LED42.1 30.8,9.21 30.8,26.35 | LED41.1 30.8,26.35 | 30.8,45.4 LED40.1 | 30.8,26.35 30.8,45.4 | 30.8,64.45 LED39.1 | 30.8,45.4 30.8,64.45 | 30.8,83.5 LED38.1 | 30.8,64.45 30.8,83.5 | LED37.1 30.8,102.55 30.8,83.5
N$54
  Top 0.203: LED42.2 33.34,9.21 33.34,26.35 | LED41.2 33.34,26.35 | 33.34,45.4 LED40.2 | 33.34,26.35 33.34,45.4 | 33.34,64.45 LED39.2 | 33.34,45.4 33.34,64.45 | 33.34,83.5 LED38.2 | 33.34,64.45 33.34,83.5 | LED37.2 33.34,102.55 33.34,83.5
N$55
  Top 0.203: LED42.4 38.42,9.21 38.42,26.35 | LED41.4 38.42,26.35 | 38.42,45.4 LED40.4 | 38.42,26.35 38.42,45.4 | 38.42,64.45 LED39.4 | 38.42,45.4 38.42,64.45 | 38.42,83.5 LED38.4 | 38.42,64.45 38.42,83.5 | LED37.4 38.42,102.55 38.42,83.5
N$56
  Top 0.203: LED42.5 40.96,9.21 40.96,26.35 | LED41.5 40.96,26.35 | 40.96,45.4 LED40.5 | 40.96,26.35 40.96,45.4 | 40.96,64.45 LED39.5 | 40.96,45.4 40.96,64.45 | 40.96,83.5 LED38.5 | 40.96,64.45 40.96,83.5 | LED37.5 40.96,102.55 40.96,83.5
N$57
  Top 0.203: LED48.10 45.4,24.45 45.4,41.59 | LED47.10 45.4,41.59 | 45.4,60.64 LED46.10 | 45.4,41.59 45.4,60.64 | 45.4,79.69 LED45.10 | 45.4,60.64 45.4,79.69 | 45.4,98.74 LED44.10 | 45.4,79.69 45.4,98.74 | LED43.10 45.4,117.79 45.4,98.74
N$58
  Top 0.203: LED48.9 47.94,24.45 47.94,41.59 | LED47.9 47.94,41.59 | 47.94,60.64 LED46.9 | 47.94,41.59 47.94,60.64 | 47.94,79.69 LED45.9 | 47.94,60.64 47.94,79.69 | 47.94,98.74 LED44.9 | 47.94,79.69 47.94,98.74 | LED43.9 47.94,117.79 47.94,98.74
N$59
  Top 0.203: LED48.1 43.5,9.21 43.5,26.35 | LED47.1 43.5,26.35 | 43.5,45.4 LED46.1 | 43.5,26.35 43.5,45.4 | 43.5,64.45 LED45.1 | 43.5,45.4 43.5,64.45 | 43.5,83.5 LED44.1 | 43.5,64.45 43.5,83.5 | LED43.1 43.5,102.55 43.5,83.5
N$60
  Top 0.203: LED48.2 46.04,9.21 46.04,26.35 | LED47.2 46.04,26.35 | 46.04,45.4 LED46.2 | 46.04,26.35 46.04,45.4 | 46.04,64.45 LED45.2 | 46.04,45.4 46.04,64.45 | 46.04,83.5 LED44.2 | 46.04,64.45 46.04,83.5 | LED43.2 46.04,102.55 46.04,83.5
N$61
  Top 0.203: LED48.4 51.12,9.21 51.12,26.35 | LED47.4 51.12,26.35 | 51.12,45.4 LED46.4 | 51.12,26.35 51.12,45.4 | 51.12,64.45 LED45.4 | 51.12,45.4 51.12,64.45 | 51.12,83.5 LED44.4 | 51.12,64.45 51.12,83.5 | LED43.4 51.12,102.55 51.12,83.5
N$62
  Top 0.203: LED48.6 55.56,24.45 55.56,41.59 | LED47.6 55.56,41.59 | 55.56,60.64 LED46.6 | 55.56,41.59 55.56,60.64 | 55.56,79.69 LED45.6 | 55.56,60.64 55.56,79.69 | 55.56,98.74 LED44.6 | 55.56,79.69 55.56,98.74 | LED43.6 55.56,117.79 55.56,98.74
N$63
  Top 0.203: LED48.7 53.02,24.45 53.02,41.59 | LED47.7 53.02,41.59 | 53.02,60.64 LED46.7 | 53.02,41.59 53.02,60.64 | 53.02,79.69 LED45.7 | 53.02,60.64 53.02,79.69 | 53.02,98.74 LED44.7 | 53.02,79.69 53.02,98.74 | LED43.7 53.02,117.79 53.02,98.74
N$64
  Top 0.203: LED48.5 53.66,9.21 53.66,26.35 | LED47.5 53.66,26.35 | 53.66,45.4 LED46.5 | 53.66,26.35 53.66,45.4 | 53.66,64.45 LED45.5 | 53.66,45.4 53.66,64.45 | 53.66,83.5 LED44.5 | 53.66,64.45 53.66,83.5 | LED43.5 53.66,102.55 53.66,83.5
N$81
  Top 0.203: LED66.7 91.12,24.45 91.12,41.59 | LED65.7 91.12,41.59 | 91.12,60.64 LED64.7 | 91.12,41.59 91.12,60.64 | 91.12,79.69 LED63.7 | 91.12,60.64 91.12,79.69 | 91.12,98.74 LED62.7 | 91.12,79.69 91.12,98.74 | LED61.7 91.12,117.79 91.12,98.74
N$82
  Top 0.203: LED66.6 93.66,24.45 93.66,41.59 | LED65.6 93.66,41.59 | 93.66,60.64 LED64.6 | 93.66,41.59 93.66,60.64 | 93.66,79.69 LED63.6 | 93.66,60.64 93.66,79.69 | 93.66,98.74 LED62.6 | 93.66,79.69 93.66,98.74 | LED61.6 93.66,117.79 93.66,98.74
N$83
  Top 0.203: LED66.10 83.5,24.45 83.5,41.59 | LED65.10 83.5,41.59 | 83.5,60.64 LED64.10 | 83.5,41.59 83.5,60.64 | 83.5,79.69 LED63.10 | 83.5,60.64 83.5,79.69 | 83.5,98.74 LED62.10 | 83.5,79.69 83.5,98.74 | LED61.10 83.5,117.79 83.5,98.74
N$84
  Top 0.203: LED66.9 86.04,24.45 86.04,41.59 | LED65.9 86.04,41.59 | 86.04,60.64 LED64.9 | 86.04,41.59 86.04,60.64 | 86.04,79.69 LED63.9 | 86.04,60.64 86.04,79.69 | 86.04,98.74 LED62.9 | 86.04,79.69 86.04,98.74 | LED61.9 86.04,117.79 86.04,98.74
N$85
  Top 0.203: LED66.1 81.6,9.21 81.6,26.35 | LED65.1 81.6,26.35 | 81.6,45.4 LED64.1 | 81.6,26.35 81.6,45.4 | 81.6,64.45 LED63.1 | 81.6,45.4 81.6,64.45 | 81.6,83.5 LED62.1 | 81.6,64.45 81.6,83.5 | LED61.1 81.6,102.55 81.6,83.5
N$86
  Top 0.203: LED66.2 84.14,9.21 84.14,26.35 | LED65.2 84.14,26.35 | 84.14,45.4 LED64.2 | 84.14,26.35 84.14,45.4 | 84.14,64.45 LED63.2 | 84.14,45.4 84.14,64.45 | 84.14,83.5 LED62.2 | 84.14,64.45 84.14,83.5 | LED61.2 84.14,102.55 84.14,83.5
N$87
  Top 0.203: LED66.4 89.22,9.21 89.22,26.35 | LED65.4 89.22,26.35 | 89.22,45.4 LED64.4 | 89.22,26.35 89.22,45.4 | 89.22,64.45 LED63.4 | 89.22,45.4 89.22,64.45 | 89.22,83.5 LED62.4 | 89.22,64.45 89.22,83.5 | LED61.4 89.22,102.55 89.22,83.5
N$88
  Top 0.203: LED66.5 91.76,9.21 91.76,26.35 | LED65.5 91.76,26.35 | 91.76,45.4 LED64.5 | 91.76,26.35 91.76,45.4 | 91.76,64.45 LED63.5 | 91.76,45.4 91.76,64.45 | 91.76,83.5 LED62.5 | 91.76,64.45 91.76,83.5 | LED61.5 91.76,102.55 91.76,83.5
N$89
  Top 0.203: LED72.10 96.2,24.45 96.2,41.59 | LED71.10 96.2,41.59 | 96.2,60.64 LED70.10 | 96.2,41.59 96.2,60.64 | 96.2,79.69 LED69.10 | 96.2,60.64 96.2,79.69 | 96.2,98.74 LED68.10 | 96.2,79.69 96.2,98.74 | LED67.10 96.2,117.79 96.2,98.74
N$90
  Top 0.203: LED72.9 98.74,24.45 98.74,41.59 | LED71.9 98.74,41.59 | 98.74,60.64 LED70.9 | 98.74,41.59 98.74,60.64 | 98.74,79.69 LED69.9 | 98.74,60.64 98.74,79.69 | 98.74,98.74 LED68.9 | 98.74,79.69 98.74,98.74 | LED67.9 98.74,117.79 98.74,98.74
N$91
  Top 0.203: LED72.1 94.3,9.21 94.3,26.35 | LED71.1 94.3,26.35 | 94.3,45.4 LED70.1 | 94.3,26.35 94.3,45.4 | 94.3,64.45 LED69.1 | 94.3,45.4 94.3,64.45 | 94.3,83.5 LED68.1 | 94.3,64.45 94.3,83.5 | LED67.1 94.3,102.55 94.3,83.5
N$92
  Top 0.203: LED72.2 96.84,9.21 96.84,26.35 | LED71.2 96.84,26.35 | 96.84,45.4 LED70.2 | 96.84,26.35 96.84,45.4 | 96.84,64.45 LED69.2 | 96.84,45.4 96.84,64.45 | 96.84,83.5 LED68.2 | 96.84,64.45 96.84,83.5 | LED67.2 96.84,102.55 96.84,83.5
N$93
  Top 0.203: LED72.4 101.92,9.21 101.92,26.35 | LED71.4 101.92,26.35 | 101.92,45.4 LED70.4 | 101.92,26.35 101.92,45.4 | 101.92,64.45 LED69.4 | 101.92,45.4 101.92,64.45 | 101.92,83.5 LED68.4 | 101.92,64.45 101.92,83.5 | LED67.4 101.92,102.55 101.92,83.5
N$94
  Top 0.203: LED72.6 106.36,24.45 106.36,41.59 | LED71.6 106.36,41.59 | 106.36,60.64 LED70.6 | 106.36,41.59 106.36,60.64 | 106.36,79.69 LED69.6 | 106.36,60.64 106.36,79.69 | 106.36,98.74 LED68.6 | 106.36,79.69 106.36,98.74 | LED67.6 106.36,117.79 106.36,98.74
N$95
  Top 0.203: LED72.7 103.82,24.45 103.82,41.59 | LED71.7 103.82,41.59 | 103.82,60.64 LED70.7 | 103.82,41.59 103.82,60.64 | 103.82,79.69 LED69.7 | 103.82,60.64 103.82,79.69 | 103.82,98.74 LED68.7 | 103.82,79.69 103.82,98.74 | LED67.7 103.82,117.79 103.82,98.74
N$96
  Top 0.203: LED72.5 104.46,9.21 104.46,26.35 | LED71.5 104.46,26.35 | 104.46,45.4 LED70.5 | 104.46,26.35 104.46,45.4 | 104.46,64.45 LED69.5 | 104.46,45.4 104.46,64.45 | 104.46,83.5 LED68.5 | 104.46,64.45 104.46,83.5 | LED67.5 104.46,102.55 104.46,83.5
ROW1  (3 unrouted)
  Top 0.203: LED13.8 LED13.3 | LED19.8 LED19.3 | LED37.8 LED37.3 | LED43.8 LED43.3 | LED25.8 LED25.3 | LED31.8 LED31.3 | LED61.8 LED61.3 | LED67.8 LED67.3
  Bottom 0.203: LED13.3 13.02,105.09 22.54,105.09 LED19.3 | LED37.3 38.42,105.09 47.94,105.09 LED43.3 | LED25.3 63.82,105.09 73.34,105.09 LED31.3 | LED61.3 89.22,105.09 98.74,105.09 LED67.3
ROW2  (3 unrouted)
  Top 0.203: LED14.8 LED14.3 | LED20.8 LED20.3 | LED38.8 LED38.3 | LED44.8 LED44.3 | LED26.8 LED26.3 | LED32.8 LED32.3 | LED62.8 LED62.3 | LED68.8 LED68.3
  Bottom 0.203: LED14.3 13.02,86.04 22.54,86.04 LED20.3 | LED38.3 38.42,86.04 47.94,86.04 LED44.3 | LED26.3 63.82,86.04 73.34,86.04 LED32.3 | LED62.3 89.22,86.04 98.74,86.04 LED68.3
ROW3  (3 unrouted)
  Top 0.203: LED15.8 LED15.3 | LED21.8 LED21.3 | LED39.8 LED39.3 | LED45.8 LED45.3 | LED27.8 LED27.3 | LED33.8 LED33.3 | LED63.8 LED63.3 | LED69.8 LED69.3
  Bottom 0.203: LED15.3 13.02,66.99 22.54,66.99 LED21.3 | LED39.3 38.42,66.99 47.94,66.99 LED45.3 | LED27.3 63.82,66.99 73.34,66.99 LED33.3 | LED63.3 89.22,66.99 98.74,66.99 LED69.3
ROW4  (3 unrouted)
  Top 0.203: LED16.8 LED16.3 | LED22.8 LED22.3 | LED40.8 LED40.3 | LED46.8 LED46.3 | LED28.8 LED28.3 | LED34.8 LED34.3 | LED64.8 LED64.3 | LED70.8 LED70.3
  Bottom 0.203: LED16.3 13.02,47.94 22.54,47.94 LED22.3 | LED40.3 38.42,47.94 47.94,47.94 LED46.3 | LED28.3 63.82,47.94 73.34,47.94 LED34.3 | LED64.3 89.22,47.94 98.74,47.94 LED70.3
ROW5  (3 unrouted)
  Top 0.203: LED17.8 LED17.3 | LED23.8 LED23.3 | LED41.8 LED41.3 | LED47.8 LED47.3 | LED29.8 LED29.3 | LED35.8 LED35.3 | LED65.8 LED65.3 | LED71.8 LED71.3
  Bottom 0.203: LED17.3 13.02,28.89 22.54,28.89 LED23.3 | LED41.3 38.42,28.89 47.94,28.89 LED47.3 | LED29.3 63.82,28.89 73.34,28.89 LED35.3 | LED65.3 89.22,28.89 98.74,28.89 LED71.3
ROW6  (3 unrouted)
  Top 0.203: LED18.8 LED18.3 | LED24.8 LED24.3 | LED42.8 LED42.3 | LED48.8 LED48.3 | LED30.8 LED30.3 | LED36.8 LED36.3 | LED66.8 LED66.3 | LED72.8 LED72.3
  Bottom 0.203: LED18.3 13.02,9.84 22.54,9.84 LED24.3 | LED42.3 38.42,9.84 47.94,9.84 LED48.3 | LED30.3 63.82,9.84 73.34,9.84 LED36.3 | LED66.3 89.22,9.84 98.74,9.84 LED72.3